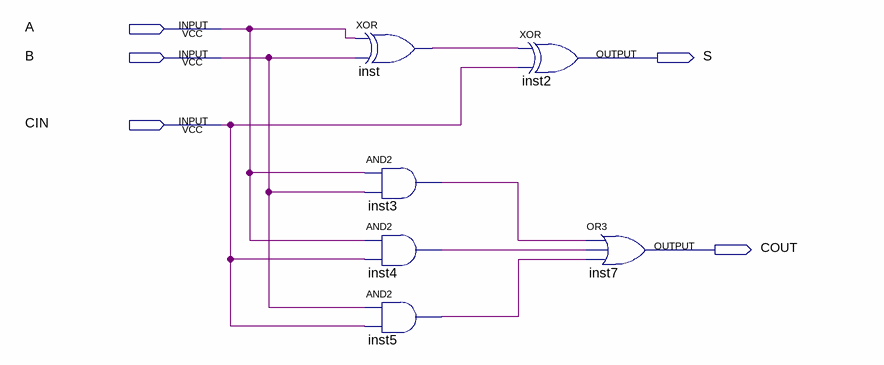
[diagram p0: schematic sheet]
// Quartus schematic FA.bdf as structural Verilog: 6 symbols, 5 pins
module FA (
  input  A,
  input  B,
  input  CIN,
  output S,
  output COUT
);

  wire inst3_out, inst4_out, inst5_out, inst_out;

  xor inst (inst_out, A, B);
  and inst3 (inst3_out, A, B);
  and inst4 (inst4_out, A, CIN);
  and inst5 (inst5_out, B, CIN);
  xor inst2 (S, inst_out, CIN);
  // OR3 inst7 has open pins: IN1=inst3_out, IN2=inst4_out, IN3=inst5_out, OUT=open
endmodule
